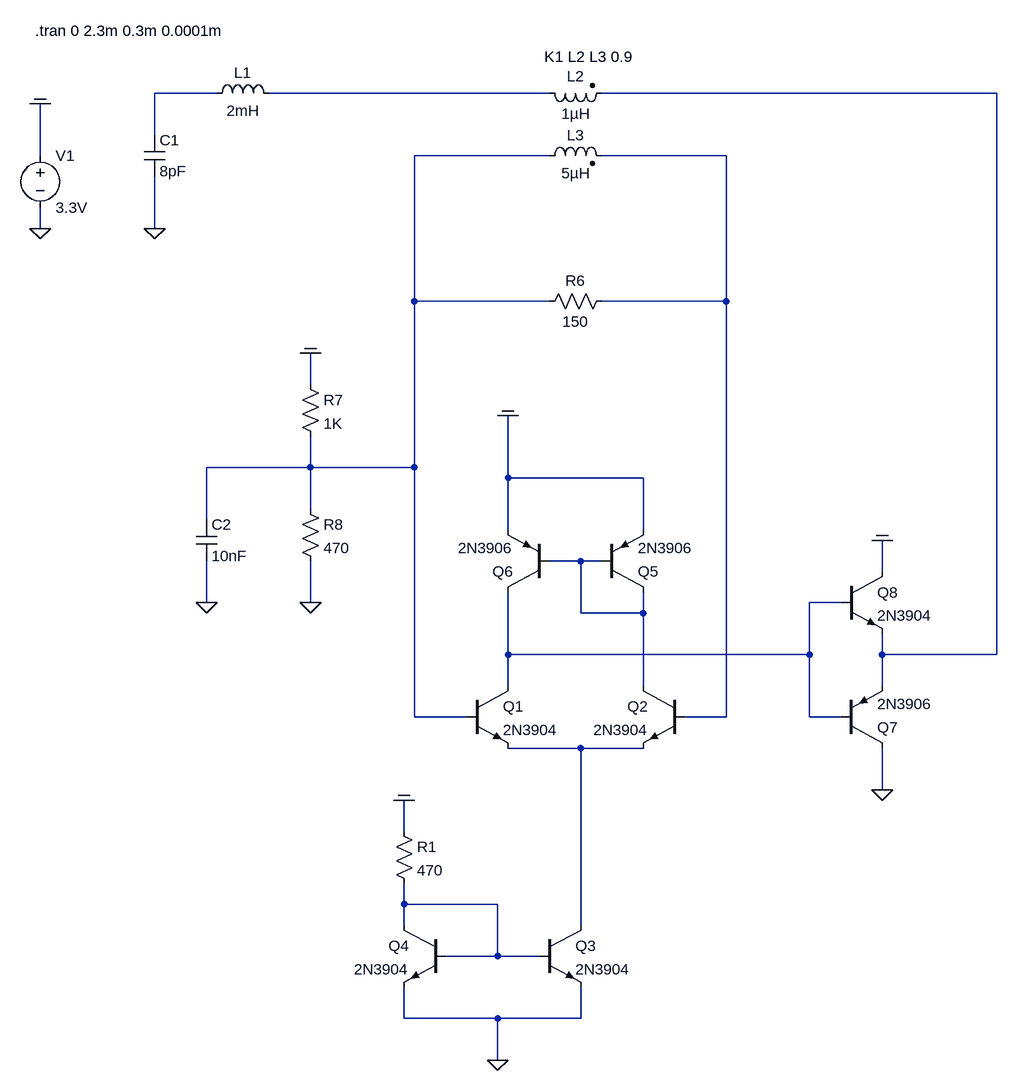
[diagram p0: schematic 2020_current_sense_bjt_v02.asc]
2020_current_sense_bjt_v02.asc, the LTspice schematic file:
Version 4
SHEET 1 3920 3748
WIRE -736 480 -832 480
WIRE -224 480 -656 480
WIRE 464 480 -144 480
WIRE -832 544 -832 480
WIRE -1008 576 -1008 496
WIRE -224 576 -432 576
WIRE 48 576 -144 576
WIRE -1008 688 -1008 656
WIRE -832 688 -832 608
WIRE -432 800 -432 576
WIRE -224 800 -432 800
WIRE 48 800 48 576
WIRE 48 800 -144 800
WIRE -592 928 -592 880
WIRE -592 1056 -592 1008
WIRE -592 1056 -752 1056
WIRE -432 1056 -432 800
WIRE -432 1056 -592 1056
WIRE -288 1072 -288 976
WIRE -80 1072 -288 1072
WIRE -592 1120 -592 1056
WIRE -752 1136 -752 1056
WIRE -288 1152 -288 1072
WIRE -80 1152 -80 1072
WIRE -176 1200 -224 1200
WIRE -144 1200 -176 1200
WIRE 288 1216 288 1168
WIRE -752 1264 -752 1200
WIRE -592 1264 -592 1200
WIRE 224 1264 176 1264
WIRE -176 1280 -176 1200
WIRE -80 1280 -80 1248
WIRE -80 1280 -176 1280
WIRE -288 1344 -288 1248
WIRE 176 1344 176 1264
WIRE 176 1344 -288 1344
WIRE 288 1344 288 1312
WIRE 464 1344 464 480
WIRE 464 1344 288 1344
WIRE -288 1392 -288 1344
WIRE -80 1392 -80 1280
WIRE 288 1392 288 1344
WIRE -432 1440 -432 1056
WIRE -352 1440 -432 1440
WIRE 48 1440 48 800
WIRE 48 1440 -16 1440
WIRE 176 1440 176 1344
WIRE 224 1440 176 1440
WIRE -176 1488 -288 1488
WIRE -80 1488 -176 1488
WIRE 288 1552 288 1488
WIRE -448 1616 -448 1568
WIRE -448 1728 -448 1696
WIRE -304 1728 -448 1728
WIRE -448 1760 -448 1728
WIRE -176 1760 -176 1488
WIRE -304 1808 -304 1728
WIRE -304 1808 -384 1808
WIRE -240 1808 -304 1808
WIRE -448 1904 -448 1856
WIRE -304 1904 -448 1904
WIRE -176 1904 -176 1856
WIRE -176 1904 -304 1904
WIRE -304 1968 -304 1904
FLAG -1008 688 0
FLAG -1008 496 COM
FLAG -832 688 0
FLAG -448 1568 COM
FLAG -304 1968 0
FLAG 288 1552 0
FLAG 288 1168 COM
FLAG -592 880 COM
FLAG -592 1264 0
FLAG -752 1264 0
FLAG -288 976 COM
SYMBOL voltage -1008 560 R0
WINDOW 123 0 0 Left 0
WINDOW 39 0 0 Left 0
SYMATTR InstName V1
SYMATTR Value 3.3V
SYMBOL ind -752 496 R270
WINDOW 0 32 56 VTop 2
WINDOW 3 5 56 VBottom 2
SYMATTR InstName L1
SYMATTR Value 2mH
SYMATTR SpiceLine Rser=85 Rpar=10Meg Cpar=1.216pF
SYMBOL cap -848 544 R0
SYMATTR InstName C1
SYMATTR Value 8pF
SYMBOL npn -352 1392 R0
SYMATTR InstName Q1
SYMATTR Value 2N3904
SYMBOL npn -16 1392 M0
SYMATTR InstName Q2
SYMATTR Value 2N3904
SYMBOL npn -240 1760 R0
SYMATTR InstName Q3
SYMATTR Value 2N3904
SYMBOL npn -384 1760 M0
SYMATTR InstName Q4
SYMATTR Value 2N3904
SYMBOL res -464 1600 R0
SYMATTR InstName R1
SYMATTR Value 470
SYMBOL pnp -144 1248 M180
SYMATTR InstName Q5
SYMATTR Value 2N3906
SYMBOL pnp -224 1248 R180
SYMATTR InstName Q6
SYMATTR Value 2N3906
SYMBOL pnp 224 1488 M180
SYMATTR InstName Q7
SYMATTR Value 2N3906
SYMBOL npn 224 1216 R0
SYMATTR InstName Q8
SYMATTR Value 2N3904
SYMBOL res -128 784 R90
WINDOW 0 0 56 VBottom 2
WINDOW 3 32 56 VTop 2
SYMATTR InstName R6
SYMATTR Value 150
SYMBOL ind2 -240 464 M90
WINDOW 0 5 56 VBottom 2
WINDOW 3 32 56 VTop 2
SYMATTR InstName L2
SYMATTR Value 1µH
SYMATTR Type ind
SYMBOL ind2 -240 592 R270
WINDOW 0 32 56 VTop 2
WINDOW 3 5 56 VBottom 2
SYMATTR InstName L3
SYMATTR Value 5µH
SYMATTR Type ind
SYMBOL res -608 912 R0
SYMATTR InstName R7
SYMATTR Value 1K
SYMBOL res -608 1104 R0
SYMATTR InstName R8
SYMATTR Value 470
SYMBOL cap -768 1136 R0
SYMATTR InstName C2
SYMATTR Value 10nF
TEXT -1016 384 Left 2 !.tran 0 2.3m 0.3m 0.0001m
TEXT -232 424 Left 2 !K1 L2 L3 0.9

The netlist it stands for:
* 2020_current_sense_bjt_v02.asc
V1 COM 0 3.3V
L1 N001 N002 2mH Rser=85 Rpar=10Meg Cpar=1.216pF
C1 N001 0 8pF
Q1 N007 N004 N008 0 2N3904
Q2 N006 N005 N008 0 2N3904
Q3 N008 N009 0 0 2N3904
Q4 N009 N009 0 0 2N3904
R1 COM N009 470
Q5 N006 N006 COM 0 2N3906
Q6 N007 N006 COM 0 2N3906
Q7 0 N007 N003 0 2N3906
Q8 COM N007 N003 0 2N3904
R6 N005 N004 150
L2 N002 N003 1µH
L3 N004 N005 5µH
R7 COM N004 1K
R8 N004 0 470
C2 N004 0 10nF
.model NPN NPN
.model PNP PNP
.lib standard.bjt
.tran 0 2.3m 0.3m 0.0001m
K1 L2 L3 0.9
.backanno
.end